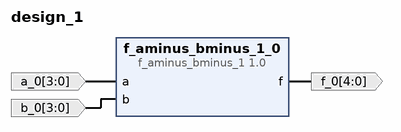
[diagram p0: block diagram of the top level]
# Vivado block design design_1, xc7a35tcpg236-1, Vivado 2019.1
create_bd_design design_1

create_bd_port -dir I -from 3 -to 0 a_0
create_bd_port -dir I -from 3 -to 0 b_0
create_bd_port -dir O -from 4 -to 0 f_0

create_bd_cell -type ip -vlnv xilinx.com:user:f_aminus_bminus_1:1.0 f_aminus_bminus_1_0

# ---- connections ----

connect_bd_net -net a_0_1 [get_bd_ports a_0] [get_bd_pins f_aminus_bminus_1_0/a]
connect_bd_net -net b_0_1 [get_bd_ports b_0] [get_bd_pins f_aminus_bminus_1_0/b]
connect_bd_net [get_bd_pins f_aminus_bminus_1_0/f] [get_bd_ports f_0]

validate_bd_design
save_bd_design
